# Altium project zb_button.PrjPcb
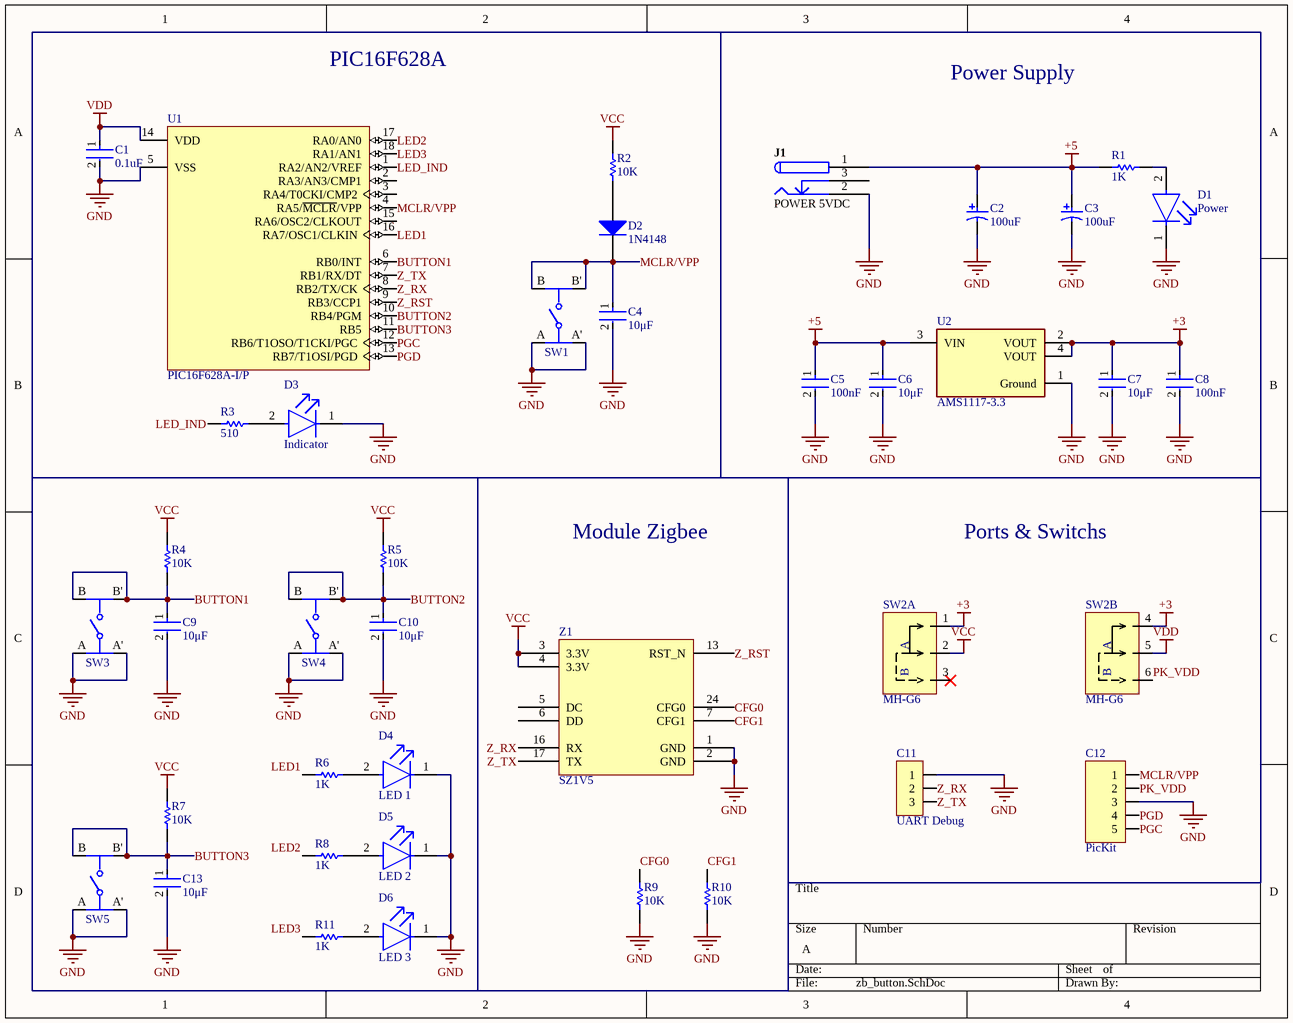
[diagram p0: zb_button.SchDoc]
1 sheet, 39 parts. Net scope: global (net labels, ports and power ports of the same name join across sheets).
Board file: zb_button.PcbDoc

## Sheet zb_button.SchDoc
size A; SheetNumber: 1; SheetTotal: 1

### Parts
C1  0.1uF  [FP-0603-L_1_6_0_15-W_0_81-MFG]
C2  100uF  [PNSC-FK-V-D8_V]
C3  100uF  [PNSC-FK-V-D8_V]
C4  10μF  [FP-0603-L_1_6_0_15-W_0_81-IPC_A]
C5  100nF  [FP-0603-L_1_6_0_15-W_0_81-IPC_A]
C6  10μF  [FP-0603-L_1_6_0_15-W_0_81-IPC_A]
C7  10μF  [FP-0603-L_1_6_0_15-W_0_81-IPC_A]
C8  100nF  [FP-0603-L_1_6_0_15-W_0_81-IPC_A]
C9  10μF  [FP-0603-L_1_6_0_15-W_0_81-IPC_A]
C10  10μF  [FP-0603-L_1_6_0_15-W_0_81-IPC_A]
C11  UART Debug  [JP3-D1C]
C12  PicKit  [JP5-D1C]
C13  10μF  [FP-0603-L_1_6_0_15-W_0_81-IPC_A]
D1  Power  [FP-HLMP-4700-MFG]
D2  1N4148  [NXP-SOD27-2_V]
D3  Indicator  [FP-HLMP-4700-MFG]
D4  LED 1  [FP-HLMP-4700-MFG]
D5  LED 2  [FP-HLMP-4700-MFG]
D6  LED 3  [FP-HLMP-4700-MFG]
J1  POWER 5VDC  [KYCN-KLDX-0202-B_V]
R1  1K  [RESC1609X55X30ML15T15]
R2  10K  [RESC1609X55X30ML15T15]
R3  510  [RESC1609X55X30ML15T15]
R4  10K  [RESC1609X55X30ML15T15]
R5  10K  [RESC1609X55X30ML15T15]
R6  1K  [RESC1609X55X30ML15T15]
R7  10K  [RESC1609X55X30ML15T15]
R8  1K  [RESC1609X55X30ML15T15]
R9  10K  [RESC1609X55X30ML15T15]
R10  10K  [RESC1609X55X30ML15T15]
R11  1K  [RESC1609X55X30ML15T15]
SW1  RESET  [FP-EVQ-PAG05R-MFG]  (value not drawn)
SW2  MH-G6  [MH-G6]  (parts A,B of 2)
SW3  BUTTON 1  [FP-EVQ-PAG05R-MFG]  (value not drawn)
SW4  BUTTON 2  [FP-EVQ-PAG05R-MFG]  (value not drawn)
SW5  BUTTON 3  [FP-EVQ-PAG05R-MFG]  (value not drawn)
U1  PIC16F628A-I/P  [PDIP300-P18]
U2  AMS1117-3.3  [FP-AMS1117-IPC_A]
Z1  SZ1V5  [SZ1V5 PINOUT MODULE]

### Nets
+3: C7.1 C8.1 SW2.1(A) SW2.4(A) U2.2(VOUT) U2.4(VOUT)
+5: C2.1 C3.1 C5.1 C6.1 J1.1 R1.2 U2.3(VIN)
GND: C1.2 C2.2 C3.2 C4.2 C5.2 C6.2 C7.2 C8.2 C9.2 C10.2 C11.1 C12.3 C13.2 D1.1(C) D3.1(C) D4.1(C) D5.1(C) D6.1(C) J1.2 R9.1 R10.1 SW1.A SW1.A' SW3.A SW3.A' SW4.A SW4.A' SW5.A SW5.A' U1.5(VSS) U2.1(Ground) Z1.1(GND) Z1.2(GND)
VCC: R2.2 R4.2 R5.2 R7.2 SW2.2(COM) Z1.3(3.3V) Z1.4(3.3V)
VDD: C1.1 SW2.5(COM) U1.14(VDD)
BUTTON1: C9.1 R4.1 SW3.B SW3.B' U1.6(RB0/INT)
BUTTON2: C10.1 R5.1 SW4.B SW4.B' U1.10(RB4/PGM)
BUTTON3: C13.1 R7.1 SW5.B SW5.B' U1.11(RB5)
CFG0: R9.2 Z1.24(CFG0)
CFG1: R10.2 Z1.7(CFG1)
LED1: R6.1 U1.16(RA7/OSC1/CLKIN)
LED2: R8.1 U1.17(RA0/AN0)
LED3: R11.1 U1.18(RA1/AN1)
LED_IND: R3.2 U1.1(RA2/AN2/VREF)
MCLR/VPP: C4.1 C12.1 D2.2(K) SW1.B SW1.B' U1.4(RA5/~{MCLR}/VPP)
PGC: C12.5 U1.12(RB6/T1OSO/T1CKI/PGC)
PGD: C12.4 U1.13(RB7/T1OSI/PGD)
PK_VDD: C12.2 SW2.6(B)
Z_RST: U1.9(RB3/CCP1) Z1.13(RST_N)
Z_RX: C11.2 U1.8(RB2/TX/CK) Z1.16(RX)
Z_TX: C11.3 U1.7(RB1/RX/DT) Z1.17(TX)
NetD1_2: D1.2(A) R1.1
NetD2_1: D2.1(A) R2.1
NetD3_2: D3.2(A) R3.1
NetD4_2: D4.2(A) R6.2
NetD5_2: D5.2(A) R8.2
NetD6_2: D6.2(A) R11.2

Not connected (* = marked no-connect by the designer): J1 3; SW2 3(B)*; U1 2(RA3/AN3/CMP1) 3(RA4/T0CKI/CMP2) 15(RA6/OSC2/CLKOUT); Z1 5(DC) 6(DD)

### Notes on the sheet
- PIC16F628A
- Power Supply
- Module Zigbee
- Ports & Switchs

### Library data of the parts
C1 C4-C10 C13 = CMP-1035-02592-4: General Purpose Ceramic Capacitor, 0603, 100nF, 10%, X7R, 15%, 50V; Dissipation Factor: 2.5%; Radiation Hardening: No; Termination: SMD/SMT; Tolerance: 10%; Lead Free: Lead Free; Width: 0.81mm; Max Operating Temperature: 125°C; Thickness: 0.035inch; Voltage Rating: 50V; Height: 0.9mm; Case/Package: 0603; Depth: 0.81mm; Number of Pins: 2; Capacitance: 100nF; REACH SVHC: No SVHC; Case Code (Imperial): 0603; Voltage: 50V; Voltage Rating (DC): 50V; Mount: Surface Mount; Length: 1.6mm; Min Operating Temperature: -55°C; Packaging: Tape and Reel; Case Code (Metric): 1608; Dielectric Material: Ceramic; Package Quantity: 1; Dielectric: X7R; Contact Plating: Tin
C2 C3 = CMP-2000-06206-1: Aluminum Electrolytic Capacitor, 100 uF, +/- 20%, 25 V, 2-Pin SMD (Size Code D8), -55 to 105 degC, RoHS, Tape and Reel; Manufacturer: Panasonic; Type: Can; Lifetime@Temperature: 2000Hrs@105°C; Capacitance: 100µF; Rated Voltage: 25V; Ripple Current: 280mA; Impedance: 0.34O; Case Size/Dimension: Ø6.3x7.7mm; Operating Temp-Max: 105°C; Series: FK; Package URL: http://industrial.panasonic.com/cdbs/www-data/pdf/RDE0000/DME0000COL48.pdf; Mounting Technology: SurfaceMount; Package Description: 2-Pin Electrolytic Aluminum Capacitor, Body 6.6 x 6.6 mm; Datasheet Version: 03/2016; Datasheet URL: http://industrial.panasonic.com/cdbs/www-data/pdf/RDE0000/ABA0000C1181.pdf; Manufacturer URL: http://www.panasonic.com/; Package Reference: FK-V-D8; Operating Temp Range: -55to+105°C
C11 = JP3: WR-PHD 2.54 mm Angled Socket Header; Manufacturer: W¨¹rth Elektronik eiSos GmbH; partNo: 613003143121; ComponentLink1 Description: Manufacturer; ComponentLink2 Description: Datasheet; NoPins: 03; Created Date: 29 March 2013; ComponentLink1URL: http://www.we-online.com; ComponentLink2URL: http://katalog.we-online.de/em/datasheet/6130xx143121.pdf; Created by: Karrer Zheng
C12 = JP5: WR-PHD 2.54 mm Angled Socket Header; Manufacturer: W¨¹rth Elektronik eiSos GmbH; partNo: 613005143121; ComponentLink1 Description: Manufacturer; ComponentLink2 Description: Datasheet; NoPins: 05; Created Date: 29 March 2013; ComponentLink1URL: http://www.we-online.com; ComponentLink2URL: http://katalog.we-online.de/em/datasheet/6130xx143121.pdf; Created by: Karrer Zheng
D1 D3-D6 = CMP-18399-000008-1: LED RED DIFFUSED T-1 3/4 T/H; Manufacturer: Broadcom; Luminous Intensity: 2.3mcd; Peak Emmision Wavelength: 635nm; Forward Voltage: 1.7V; Viewing Angle: 50°; Led Orientation: Straight; Reverse Voltage: 5V; Forward Current: 2mA; Power Dissipation: 14mW; Wavelength: 626nm; Digikey Description: LED RED DIFFUSED T-1 3/4 T/H; Device Class L3: unset; Temperature Range Low: -40°C; Temperature Range High: +100°C; RoHS: TRUE; Package: HLMP-4700; Octopart: https://octopart.com/hlmp-4700-broadcom-71130526; Automotive: No; ComponentLink2URL: https://docs.broadcom.com/docs/AV02-1557EN; Colour: Red; Temperature: -40°C to +100°C; Lead Free: Yes; Category: Diode; ComponentLink2Description: Datasheet; Manufacturer Part Number: HLMP-4700; Device Class L1: Optoelectronics; Device Class L2: LEDs; Mouser Description: LED; Red; 2.3mcd; 0.24In.Dia.; T-1-3/4; 500mA; 1.7V; 635nm; 50deg; 5V; 24mW; -55degC;
D2 = CMP-0648-00002-1: High-speed Diode, 100 V, 450 mA, 2-Pin SOD27, RoHS; Manufacturer: NXP Semiconductors; Configuration: Single; IR (VR: 20 V)=25 nA; IFRM: 450 mA; IFSM: 4 A Max.; Trr: 4 ns Max.; Cd: 4 pF Max.; VR: 100 V Max.; VF (IF: 10 mA)=1 V; IF: 200 mA Max.; ComponentLink1Description: Manufacturer URL; RoHS: TRUE; ComponentLink1URL: http://www.nxp.com/; ComponentLink3Description: Package Specification; DatasheetVersion: Aug-04; ComponentLink2Description: Datasheet; PackageVersion: Aug-04; PackageReference: SOD27; ComponentLink3URL: http://www.nxp.com/documents/data_sheet/1N4148_1N4448.pdf; Mounting Technology: Through Hole; ComponentLink2URL: http://www.nxp.com/documents/data_sheet/1N4148_1N4448.pdf; PartNumber: 1N4148; PackageDescription: 2-Pin Hermetically Sealed Glass Package, Axial Leaded, Dia 1.85 mm, Body Length 4.25 mm, Lead Spread 25.4 mm
J1 = CMP-0256-00001-1: 3 Conductor Power Jack, 2 break 2 aux contacts; PartNumber: KLDX-0202-B; ComponentLink2URL: http://anacapa.kycon.com/Catalog_PDF/KLDX_0202.pdf; PackageReference: KLDX-0202-B; Contact Finish: Brass; ComponentLink2Description: Datasheet; Mounting Technology: Through Hole; PackageDescription: Jack, 9 x 14.5 mm Body, 2.5 mm Center Pin Diameter; ComponentLink1Description: Manufacturer URL; ComponentLink1URL: http://kycon.com/
R1-R11 = CMP-1012-00623-3: Chip Resistor, 10 KOhm, +/- 1%, 0.1 W, -55 to 155 degC, 0603 (1608 Metric), RoHS, Tape and Reel; Manufacturer: Panasonic; Voltage Rating: 75V; Case\/Package: 0603; Power Rating: 100mW; Resistance: 10KOhm; Temperature Coefficient: 100ppm\/degreesC; Number of Pins: 2; Package Reference: 603; Depth: 0.8mm; Mount: SurfaceMount; Package Description: 2-Pin Surface Mount Device, Body 1.6 x 0.85 mm; Datasheet Version: 02/2017; Length: 1.6mm; Lead Free: LeadFree; Height: 0.45mm; Number of Terminations: 2; Max Power Dissipation: 100mW; Min Operating Temperature: -55degC; Datasheet URL: https://industrial.panasonic.com/cdbs/www-data/pdf/RDA0000/AOA0000C304.pdf; Termination: SMD/SMT; Case Code (Metric): 1608; Case Code (Imperial): 0603; Tolerance: 1%; Max Operating Temperature: 155degC; RoHSCompliant: true; Voltage Rating (DC): 75V; Radiation Hardening: No; Packaging: TapeandReel; Composition: ThickFilm; Mounting Technology: SurfaceMount; Manufacturer URL: http://www.panasonic.com/; Width: 0.031inch; REACH SVHC: NoSVHC; Contact Plating: Tin; Military Standard: Not; Package Quantity: 1
SW1 SW3-SW5 = CMP-05618-000039-1: SWITCH TACTILE SPST-NO 0.02A 15V; Electrical Life: 50000Cycles; Actuator Color: Red; Switch Function: Off-Mom; Actuator Type: Standard; Max Current Rating: 20mA; Contact Resistance: 50mR; Operating Force: 2.6N; Switch Travel: 0.25mm; Illumination Type: Non-Illuminated; Throw Configuration: SPST; Actuator Length: 1.6mm; Max Operating Temperature: 70°C; Mount: Through Hole; RoHS Compliant: Yes; Depth: 6.5mm; Radiation Hardening: No; Orientation: Straight; Width: 6mm; REACH SVHC: No SVHC; Voltage Rating (DC): 15V; Package Quantity: 500; Size: 6mm; Max Voltage Rating (DC): 15V; Mechanical Life: 50000Cycles; Contact Current Rating: 20mA; Contact Plating: Silver; Lead Free: Lead Free; Series: EVQPA; Height: 5mm; Length: 6mm; Min Operating Temperature: -20°C; Current Rating: 20mA; Termination: PC Pin; Packaging: Bulk
SW2 = MH-G6: 6-pin switch MH-G6 2.54mm
U1 = CMP-0115-00122-1: FLASH-Based 8-Bit CMOS Microcontroller with nanoWatt Technology, 2K (x14-Bit words) FLASH, 224 Bytes SRAM, 18-Pin PDIP, 3.0 to 5.5V Supply Range, Industrial Temperature; DatasheetVersion: revF, Mar-2007; PackageReference: PDIP300-P18; PackageDescription: 18-Lead Plastic Dual In-Line (P) - 300 mil Body [PDIP]; PackageVersion: revBB, Aug-2009; Code_JEDEC: MS-001
U2 = CMP-209535-000001-1: LDO Voltage Regulators 1A, 3.3V; Manufacturer: Advanced Monolithic Systems; Dropout Voltage: 1.1V; Output Type: Fixed; Nominal Supply Current: 5mA; Max Power Dissipation: 1.2W; Max Supply Voltage: 15V; Number Of Outputs: 1; Standoff Height: 0.64mm; Max Junction Temp: +125°C; Height: 1.8mm; Package: AMS1117; Device Class L2: Power Management ICs; ComponentLink2Description: Datasheet; ComponentLink2URL: http://www.advanced-monolithic.com/pdf/ds1117.pdf; Category: IC; RoHS: TRUE; Automotive: No; Device Class L1: Integrated Circuits (ICs); Output Current: 1A; Device Class L3: Voltage Regulators - Linear; Temperature: -40°C to +125°C; Output Voltage: 3.3V; Manufacturer Part Number: AMS1117-3.3; Temperature Range Low: -40°C; Octopart: https://octopart.com/ams1117-3.3-advanced+monolithic+systems-25899300; Lead Free: Yes; Ipc Land Pattern Name: SOT229P700X180-4; Temperature Range High: +125°C
Z1 = SZ1V5_Alt